# EAGLE design raspi-connector (EAGLE 8.7.0)
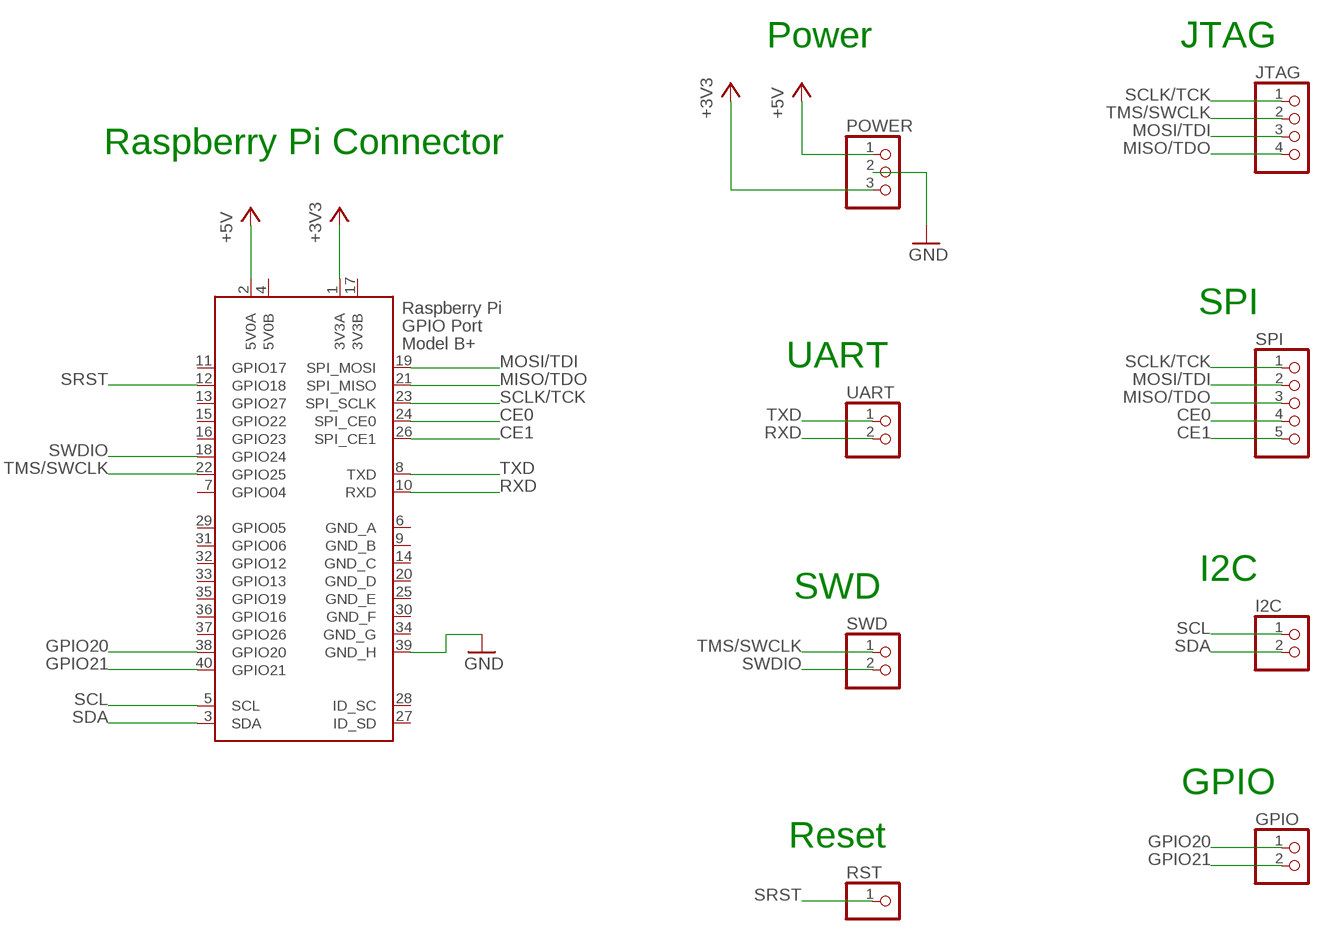
[diagram p0: schematic, sheet 1]

## Parts
GPIO  PINHD-1X2  [1X02]
I2C  PINHD-1X2  [1X02]
JTAG  PINHD-1X4  [1X04]
POWER  PINHD-1X3  [1X03]
RST  PINHD-1X1  [1X01]
SPI  PINHD-1X5  [1X05]
SWD  PINHD-1X2  [1X02]
UART  PINHD-1X2  [1X02]
X1  RASPI_BOARD_B+#  [RASPI_BOARD_B+HAT_SMALL]

## Nets
+3V3 [power]: POWER.3 X1.1(3V3A)
+5V [power]: POWER.1 X1.2(5V0A)
CE0: SPI.4 X1.24(SPI_CE0)
CE1: SPI.5 X1.26(SPI_CE1)
GND [gnd]: POWER.2 X1.39(GND_H)
GPIO20: GPIO.1 X1.38(GPIO20)
GPIO21: GPIO.2 X1.40(GPIO21)
MISO/TDO: JTAG.4 SPI.3 X1.21(SPI_MISO)
MOSI/TDI: JTAG.3 SPI.2 X1.19(SPI_MOSI)
RXD: UART.2 X1.10(RXD)
SCL: I2C.1 X1.5(SCL)
SCLK/TCK: JTAG.1 SPI.1 X1.23(SPI_SCLK)
SDA: I2C.2 X1.3(SDA)
SRST: RST.1 X1.12(GPIO18)
SWDIO: SWD.2 X1.18(GPIO24)
TMS/SWCLK: JTAG.2 SWD.1 X1.22(GPIO25)
TXD: UART.1 X1.8(TXD)
Unconnected: X1.7(GPIO04) X1.11(GPIO17) X1.13(GPIO27) X1.15(GPIO22) X1.16(GPIO23) X1.27(ID_SD) X1.28(ID_SC) X1.29(GPIO05) X1.31(GPIO06) X1.32(GPIO12) X1.33(GPIO13) X1.35(GPIO19) X1.36(GPIO16) X1.37(GPIO26)

## Notes on the sheet
- Power | JTAG
- Raspberry Pi Connector
- SPI
- UART
- I2C
- SWD
- GPIO
- Reset

## Power pins joined to a net without a drawn wire
3V3B: X1.17(3V3B)
5V0B: X1.4(5V0B)
GND_A: X1.6(GND_A)
GND_B: X1.9(GND_B)
GND_C: X1.14(GND_C)
GND_D: X1.20(GND_D)
GND_E: X1.25(GND_E)
GND_F: X1.30(GND_F)
GND_G: X1.34(GND_G)

## Library data of the parts
GPIO I2C SWD UART = pinhead:PINHD-1X2: PIN HEADER
JTAG = pinhead:PINHD-1X4: PIN HEADER
POWER = pinhead:PINHD-1X3: PIN HEADER
RST = pinhead:PINHD-1X1: PIN HEADER
SPI = pinhead:PINHD-1X5: PIN HEADER
X1 = raspi:RASPI_BOARD_B+#: Raspberry Pi GPIO connector with markings for the outer dimensions of the Raspberry Pi board model B+ with different sets of drill holes or mounting pads All pins connected

## Net classes
1 gnd: width 0.711 mm, drill 0.305 mm
2 power: width 0.61 mm, drill 0.203 mm

## Board
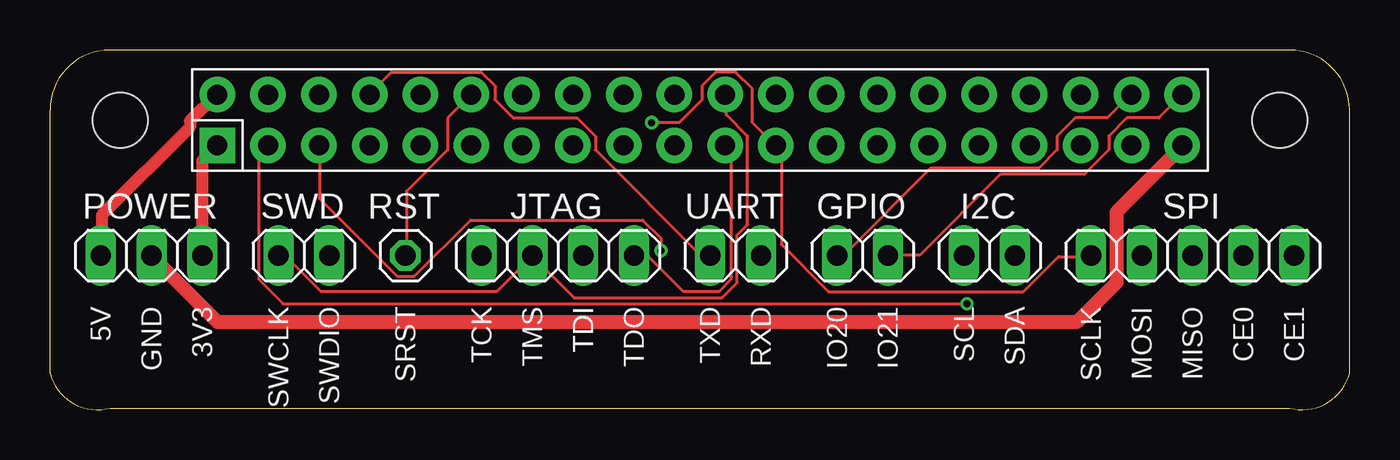
[diagram p1: board, top side]
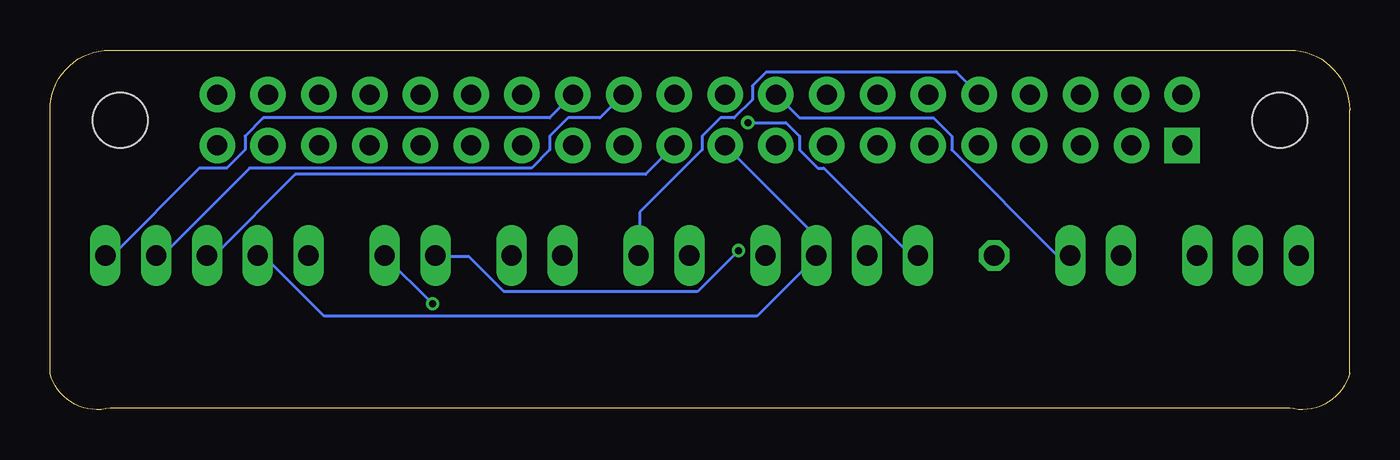
[diagram p2: board, bottom side, seen from below]

Size 65 x 17.98 mm. Coordinates in mm from the lower left corner, seen from the top.
Copper layers (1*16): Top 0.035mm / dielectric 1.6mm / Bottom 0.035mm
Design rules "Elecrow_2-layer_PCB_eagle_rule": minimum track width 6mil, minimum drill 12mil, track to track 6mil, track to pad 6mil, pad to pad 6mil, via to via 8mil, smd to smd 0mil, copper to edge 20mil, drill to drill 10mil, minimum pad ring 6mil, minimum via ring 6mil, stop-mask expansion 0mil, vias tented up to drill 100mil, thermal gap 10mil

### Footprints (pad centres in the part's own frame; a part is rotated, then mirrored left to right if it is on the bottom)
1X02 = drill 1.016 long: 1 -1.27,0; 2 1.27,0
1X04 = drill 1.016 long: 1 -3.81,0; 2 -1.27,0; 3 1.27,0; 4 3.81,0
1X03 = drill 1.016 long: 1 -2.54,0; 2 0,0; 3 2.54,0
1X01 = drill 1.016 octagon: 1 0,0
1X05 = drill 1.016 long: 1 -5.08,0; 2 -2.54,0; 3 0,0; 4 2.54,0; 5 5.08,0
RASPI_BOARD_B+HAT_SMALL = drill 1 pad 1.778 square: 1 8.37,18.21 | drill 1 pad 1.778: 2 8.37,20.75; 3 10.91,18.21; 4 10.91,20.75; 5 13.45,18.21; 6 13.45,20.75; 7 15.99,18.21; 8 15.99,20.75; 9 18.53,18.21; 10 18.53,20.75; 11 21.07,18.21; 12 21.07,20.75; 13 23.61,18.21; 14 23.61,20.75; 15 26.15,18.21; 16 26.15,20.75; 17 28.69,18.21; 18 28.69,20.75; 19 31.23,18.21; 20 31.23,20.75; 21 33.77,18.21; 22 33.77,20.75; 23 36.31,18.21; 24 36.31,20.75; 25 38.85,18.21; 26 38.85,20.75; 27 41.39,18.21; 28 41.39,20.75; 29 43.93,18.21; 30 43.93,20.75; 31 46.47,18.21; 32 46.47,20.75; 33 49.01,18.21; 34 49.01,20.75; 35 51.55,18.21; 36 51.55,20.75; 37 54.09,18.21; 38 54.09,20.75; 39 56.63,18.21; 40 56.63,20.75 | hole 2.75: 3.5,19.48; 61.5,19.48

### Placement (x,y rotation side)
GPIO  40.64,7.7 0 top
I2C  46.99,7.7 0 top
JTAG  25.4,7.7 0 top
POWER  5.08,7.7 0 top
RST  17.78,7.7 0 top
SPI  57.15,7.7 0 top
SWD  12.7,7.7 0 top
UART  34.29,7.7 0 top
X1  0,-5 0 top

### Tracks (layer width: path | path; a pad name or v marks a point on that pad's centre or on a via)
+3V3
  Top 0.61: POWER.3 7.62,12.45 8.31,13.14 X1.1
+5V
  Top 0.61: POWER.1 2.59,7.73 2.59,9.71 7.01,14.13 7.01,14.43 8.31,15.73 X1.2
CE0
  Bottom 0.152: SPI.4 59.66,7.73 59.36,7.73 55.02,12.07 40.92,12.07 40.01,12.99 40.01,13.67 39.09,14.59 37.49,14.59 36.35,15.73 X1.24
CE1
  Bottom 0.152: SPI.5 62.18,7.73 61.87,7.73 57.53,12.07 56.16,12.07 55.24,12.99 55.24,13.67 54.33,14.59 40.01,14.59 38.86,15.73 X1.26
GND
  Top 0.711: POWER.2 5.11,7.65 8.38,4.38 51.36,4.38 53.34,6.36 53.34,9.86 56.62,13.14 X1.39
GPIO20
  Top 0.152: GPIO.1 39.4,7.73 39.7,7.73 44.04,12.07 49.45,12.07 50.37,12.99 50.37,13.67 51.28,14.59 52.88,14.59 54.03,15.73 X1.38
GPIO21
  Top 0.152: GPIO.2 41.91,7.73 43.51,7.73 47.55,11.77 51.74,11.77 52.96,12.99 52.96,13.67 53.87,14.59 55.47,14.59 56.62,15.73 X1.40
MISO/TDO
  Top 0.152: JTAG.4 29.26,7.65 29.95,7.65 31.7,5.9 33.45,5.9 34.06,6.51 34.06,12.91 33.83,13.14 X1.21
  Bottom 0.152: SPI.3 57.15,7.73 56.77,7.73 52.73,11.77 35.2,11.77 33.83,13.14 X1.21
MOSI/TDI
  Bottom 0.152: X1.19 31.17,13.14 26.67,8.64 JTAG.3 26.67,7.65 29.64,4.68 51.28,4.68 54.25,7.65 54.56,7.65 SPI.2
RXD
  Bottom 0.152: UART.2 35.51,7.73 35.51,9.86 32.38,12.99 32.38,13.67 31.47,14.59 30.79,14.59 29.87,15.5 29.87,16.19 29.18,16.87 19.66,16.87 18.59,15.81 X1.10
SCL  (via drill 0.35)
  Top 0.152: v30.56,7.96 30.56,8.57 29.64,9.48 21.03,9.48 18.21,6.66 17.37,6.66 13.49,10.55 13.49,13.14 X1.5
  Bottom 0.152: v30.56,7.96 32.61,5.9 42.29,5.9 44.04,7.65 45.72,7.65 I2C.1
SCLK/TCK  (via drill 0.35)
  Top 0.152: v30.1,14.36 31.47,14.36 32.61,15.5 32.61,16.19 33.3,16.87 34.29,16.87 35.13,16.03 35.13,14.36 36.27,13.22 X1.23 36.35,13.14 36.58,12.91 36.58,8.26 38.94,5.9 48.69,5.9 50.44,7.65 52.05,7.65 SPI.1
  Bottom 0.152: v30.1,14.36 28.19,14.36 27.51,13.67 27.51,12.99 26.59,12.07 26.29,12.07 21.95,7.73 21.64,7.73 JTAG.1
SDA  (via drill 0.35)
  Top 0.152: v45.87,5.29 11.66,5.29 10.44,6.51 10.44,12.68 10.9,13.14 X1.3
  Bottom 0.152: v45.87,5.29 48.23,7.65 I2C.2
SRST
  Top 0.152: RST.1 17.83,7.73 17.83,10.93 19.89,12.99 19.89,14.59 21.03,15.73 X1.12
SWDIO
  Bottom 0.152: SWD.2 14.02,7.73 14.63,7.73 19.89,12.99 19.89,13.67 20.8,14.59 27.51,14.59 28.65,15.73 X1.18
TMS/SWCLK
  Top 0.152: SWD.1 11.43,7.65 11.81,7.65 13.56,5.9 22.33,5.9 JTAG.2 24.16,7.65 26.21,5.6 33.6,5.6 34.37,6.36 34.37,8.72 34.9,9.25 34.9,13.67 33.83,14.74 33.83,15.73 X1.22
TXD
  Top 0.152: UART.1 32.99,7.73 32.54,7.73 27.28,12.99 27.28,13.67 26.36,14.59 23.16,14.59 22.25,15.5 22.25,16.19 21.57,16.87 17.07,16.87 16,15.81 X1.8

### Text on the board
tPlace: 5V | GND | 3V3 | SWCLK | SWDIO | SRST | TCK | TMS | TDI | TDI | TDO | TXD | RXD | IO20 | IO21 | SCL | SDA | SCLK | MOSI | MISO | CE0 | CE1